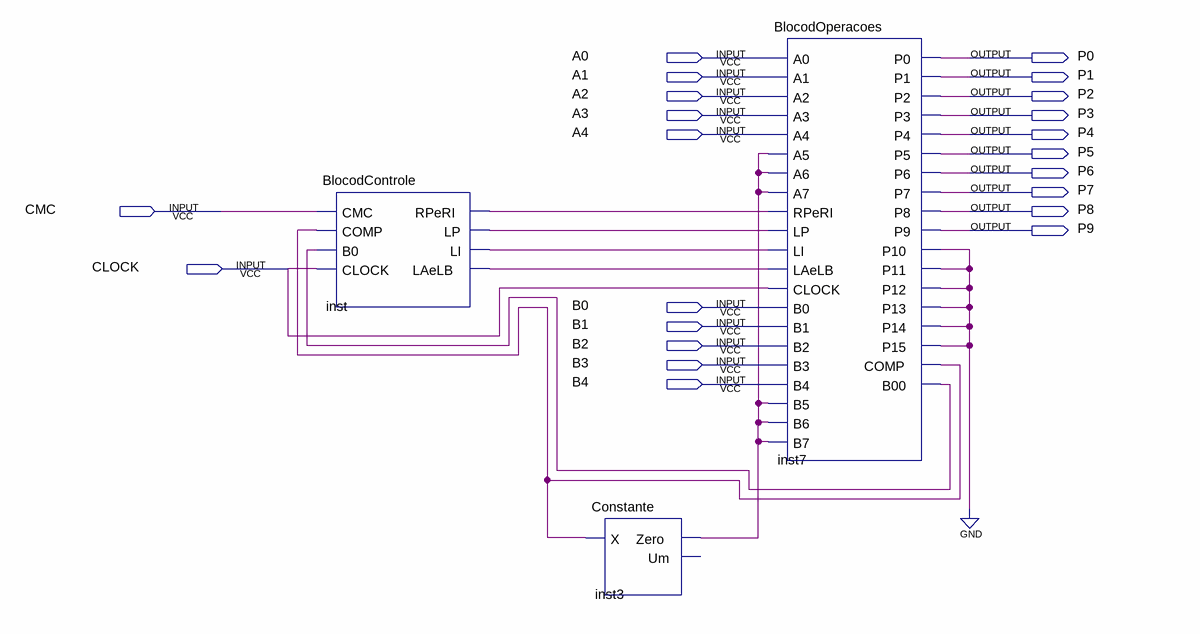
[diagram p0: schematic sheet]
// Quartus schematic MultiplicadorF.bdf as structural Verilog: 3 symbols, 22 pins
module MultiplicadorF (
  input  A0,
  input  A1,
  input  A2,
  input  A3,
  input  A4,
  input  CMC,
  input  CLOCK,
  input  B0,
  input  B1,
  input  B2,
  input  B3,
  input  B4,
  output P0,
  output P1,
  output P2,
  output P3,
  output P4,
  output P5,
  output P6,
  output P7,
  output P8,
  output P9
);

  wire inst3_zero, inst7_b00, inst7_comp, inst7_p10, inst_laelb, inst_li, inst_lp, inst_rperi;

  BlocodControle inst (
    .CMC(CMC), .COMP(inst7_comp), .B0(inst7_b00), .CLOCK(CLOCK), .RPeRI(inst_rperi), .LP(inst_lp),
    .LI(inst_li), .LAeLB(inst_laelb));
  Constante inst3 (.X(inst7_comp), .Zero(inst3_zero));  // open: Um
  BlocodOperacoes inst7 (
    .A0(A0), .A1(A1), .A2(A2), .A3(A3), .A4(A4), .A5(inst3_zero), .A6(inst3_zero), .A7(inst3_zero),
    .RPeRI(inst_rperi), .LP(inst_lp), .LI(inst_li), .LAeLB(inst_laelb), .CLOCK(CLOCK), .B0(B0), .B1(B1),
    .B2(B2), .B3(B3), .B4(B4), .B5(inst3_zero), .B6(inst3_zero), .B7(inst3_zero), .P0(P0), .P1(P1), .P2(P2),
    .P3(P3), .P4(P4), .P5(P5), .P6(P6), .P7(P7), .P8(P8), .P9(P9), .P10(inst7_p10), .P11(inst7_p10),
    .P12(inst7_p10), .P13(inst7_p10), .P14(inst7_p10), .P15(inst7_p10), .COMP(inst7_comp), .B00(inst7_b00));
  // also tied to GND on the sheet: inst7_p10
endmodule
